# Altium project diplomka_hiearchical.PrjPcb (part 2 of 4)

## Sheet TPs.SchDoc
size A4; DocumentNumber: 2; SheetNumber: 4; SheetTotal: 5
Used 40 times, as channels U_ALL_channels/8pins1/dTP, U_ALL_channels/8pins1/dTP, U_ALL_channels/8pins1/dTP, U_ALL_channels/8pins1/dTP, U_ALL_channels/8pins2/dTP, U_ALL_channels/8pins2/dTP, U_ALL_channels/8pins2/dTP, U_ALL_channels/8pins2/dTP, U_ALL_channels/8pins3/dTP, U_ALL_channels/8pins3/dTP, U_ALL_channels/8pins3/dTP, U_ALL_channels/8pins3/dTP, U_ALL_channels/8pins4/dTP, U_ALL_channels/8pins4/dTP, U_ALL_channels/8pins4/dTP, U_ALL_channels/8pins4/dTP, U_ALL_channels/8pins5/dTP, U_ALL_channels/8pins5/dTP, U_ALL_channels/8pins5/dTP, U_ALL_channels/8pins5/dTP, U_ALL_channels/8pins6/dTP, U_ALL_channels/8pins6/dTP, U_ALL_channels/8pins6/dTP, U_ALL_channels/8pins6/dTP, U_ALL_channels/8pins7/dTP, U_ALL_channels/8pins7/dTP, U_ALL_channels/8pins7/dTP, U_ALL_channels/8pins7/dTP, U_ALL_channels/8pins8/dTP, U_ALL_channels/8pins8/dTP, U_ALL_channels/8pins8/dTP, U_ALL_channels/8pins8/dTP, U_ALL_channels/8pins9/dTP, U_ALL_channels/8pins9/dTP, U_ALL_channels/8pins9/dTP, U_ALL_channels/8pins9/dTP, U_ALL_channels/8pins10/dTP, U_ALL_channels/8pins10/dTP, U_ALL_channels/8pins10/dTP, U_ALL_channels/8pins10/dTP. Parts and nets are listed once, with the designators drawn on the sheet.
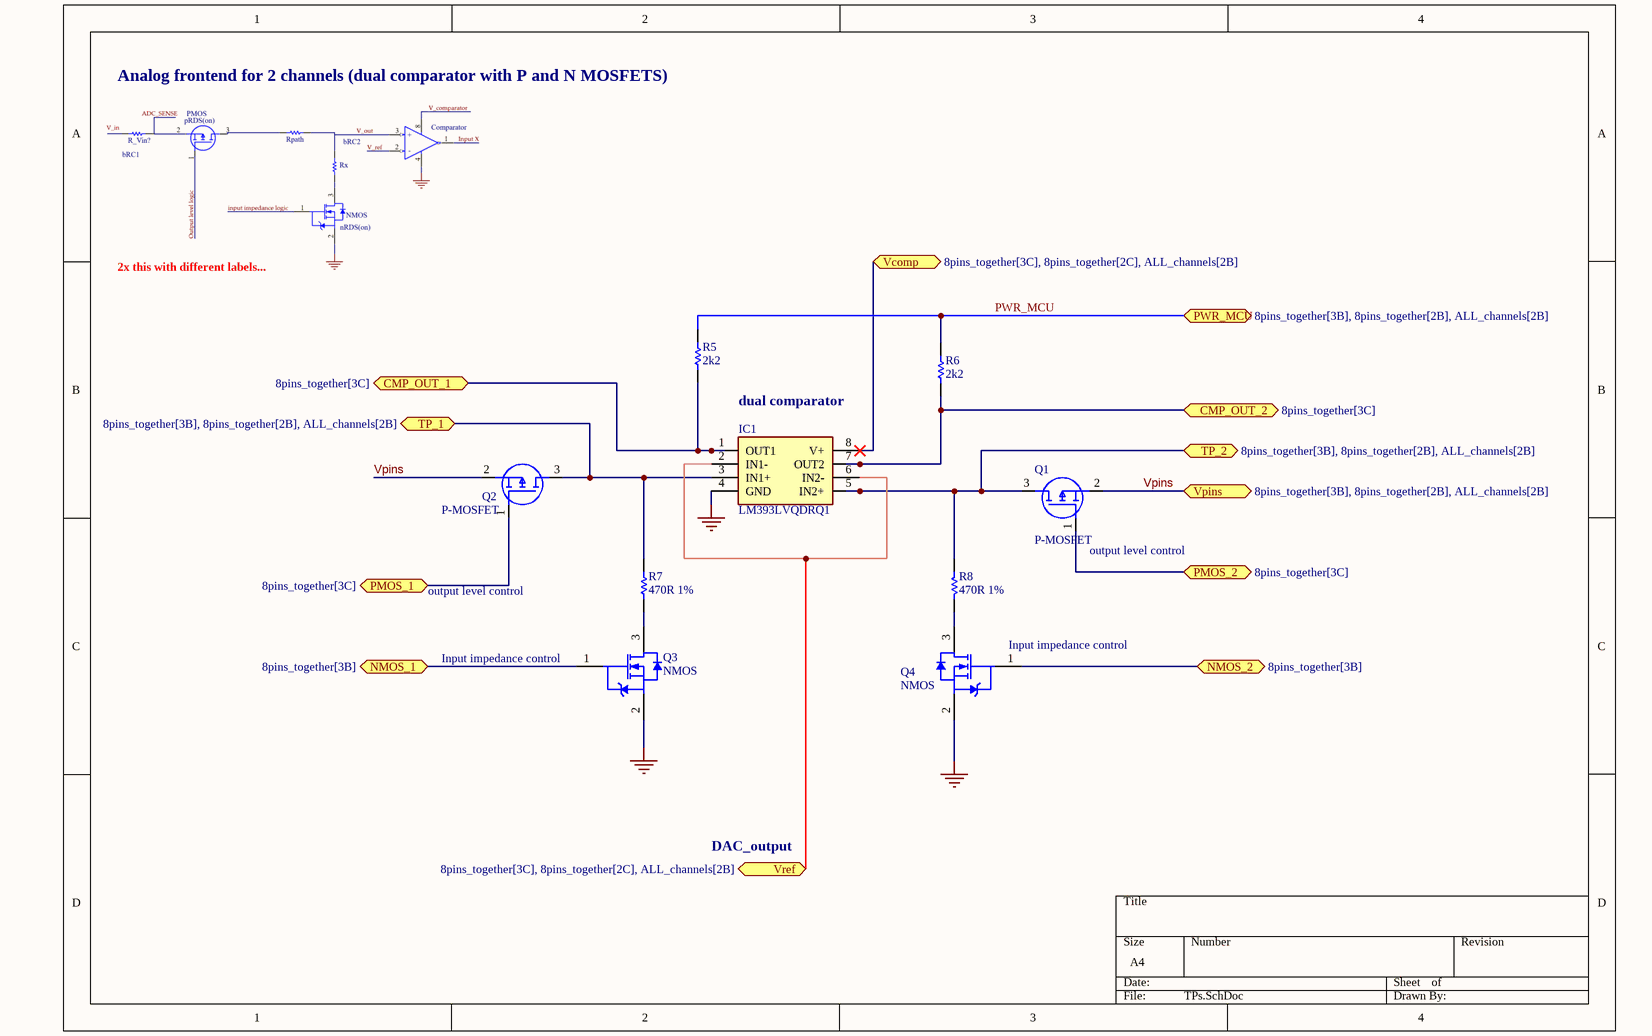
[diagram p3: TPs.SchDoc]

### Parts
IC1  LM393LVQDRQ1  [SOIC127P600X175-8N]
Q1  P-MOSFET  [SOTFL95P240X88-3N]
Q2  P-MOSFET  [SOTFL95P240X88-3N]
Q3  NMOS  [SOT95P240X110-3N]
Q4  NMOS  [SOT95P240X110-3N]
R5  2k2  [RESC1005X40X25NL05T05]
R6  2k2  [RESC1005X40X25NL05T05]
R7  470R 1%  [RESC1005X40X25NL05T05]
R8  470R 1%  [RESC1005X40X25NL05T05]

### Ports
CMP_OUT_1 (bidir, see 8pins_together[3C]), CMP_OUT_2 (bidir, see 8pins_together[3C]), NMOS_1 (bidir, see 8pins_together[3B]), NMOS_2 (bidir, see 8pins_together[3B]), PMOS_1 (bidir, see 8pins_together[3C]), PMOS_2 (bidir, see 8pins_together[3C]), PWR_MCU (bidir, see 8pins_together[3B], 8pins_together[2B], ALL_channels[2B]), TP_1 (bidir, see 8pins_together[3B], 8pins_together[2B], ALL_channels[2B]), TP_2 (bidir, see 8pins_together[3B], 8pins_together[2B], ALL_channels[2B]), Vcomp (bidir, see 8pins_together[3C], 8pins_together[2C], ALL_channels[2B]), Vpins (bidir, see 8pins_together[3B], 8pins_together[2B], ALL_channels[2B]), Vref (bidir, see 8pins_together[3C], 8pins_together[2C], ALL_channels[2B])

### Nets
GND: IC1.4(GND) Q3.2(S) Q4.2(S)
CMP_OUT_1: IC1.1(OUT1) R5.2 ; port CMP_OUT_1
CMP_OUT_2: IC1.7(OUT2) R6.2 ; port CMP_OUT_2
NMOS_1: Q3.1(G) ; port NMOS_1
NMOS_2: Q4.1(G) ; port NMOS_2
PMOS_1: Q2.1(G) ; port PMOS_1
PMOS_2: Q1.1(G) ; port PMOS_2
PWR_MCU: R5.1 R6.1 ; port PWR_MCU
TP_1: IC1.3(IN1+) Q2.3(D) R7.1 ; port TP_1
TP_2: IC1.5(IN2+) Q1.3(D) R8.1 ; port TP_2
Vcomp: IC1.8(V+) ; port Vcomp
Vpins: Q1.2(S) Q2.2(S) ; port Vpins
Vref: IC1.2(IN1-) IC1.6(IN2-) ; port Vref
NetQ3_3: Q3.3(D) R7.2
NetQ4_3: Q4.3(D) R8.2

### Channels
U_ALL_channels/8pins1/dTP: designators IC1=U_ALL_channels_8pins1_dTP_IC1#1 Q1=U_ALL_channels_8pins1_dTP_Q1#1 Q2=U_ALL_channels_8pins1_dTP_Q2#1 Q3=U_ALL_channels_8pins1_dTP_Q3#1 Q4=U_ALL_channels_8pins1_dTP_Q4#1 R5=U_ALL_channels_8pins1_dTP_R5#1 R6=U_ALL_channels_8pins1_dTP_R6#1 R7=U_ALL_channels_8pins1_dTP_R7#1 R8=U_ALL_channels_8pins1_dTP_R8#1; ports CMP_OUT_1=Net8pins1_U3_2 CMP_OUT_2=Net8pins1_U3_4 NMOS_1=Net8pins1_U2_6 NMOS_2=Net8pins1_U2_7 PMOS_1=Net8pins1_U4_6 PMOS_2=Net8pins1_U4_7 PWR_MCU=PWR_MCU TP_1=TP_7 TP_2=TP_8 Vcomp=Vcomp Vpins=Vpins Vref=Vref
U_ALL_channels/8pins1/dTP: designators IC1=U_ALL_channels_8pins1_dTP_IC1#2 Q1=U_ALL_channels_8pins1_dTP_Q1#2 Q2=U_ALL_channels_8pins1_dTP_Q2#2 Q3=U_ALL_channels_8pins1_dTP_Q3#2 Q4=U_ALL_channels_8pins1_dTP_Q4#2 R5=U_ALL_channels_8pins1_dTP_R5#2 R6=U_ALL_channels_8pins1_dTP_R6#2 R7=U_ALL_channels_8pins1_dTP_R7#2 R8=U_ALL_channels_8pins1_dTP_R8#2; ports CMP_OUT_1=Net8pins1_U3_1 CMP_OUT_2=Net8pins1_U3_5 NMOS_1=Net8pins1_U2_4 NMOS_2=Net8pins1_U2_5 PMOS_1=Net8pins1_U4_4 PMOS_2=Net8pins1_U4_5 PWR_MCU=PWR_MCU TP_1=TP_5 TP_2=TP_6 Vcomp=Vcomp Vpins=Vpins Vref=Vref
U_ALL_channels/8pins1/dTP: designators IC1=U_ALL_channels_8pins1_dTP_IC1#3 Q1=U_ALL_channels_8pins1_dTP_Q1#3 Q2=U_ALL_channels_8pins1_dTP_Q2#3 Q3=U_ALL_channels_8pins1_dTP_Q3#3 Q4=U_ALL_channels_8pins1_dTP_Q4#3 R5=U_ALL_channels_8pins1_dTP_R5#3 R6=U_ALL_channels_8pins1_dTP_R6#3 R7=U_ALL_channels_8pins1_dTP_R7#3 R8=U_ALL_channels_8pins1_dTP_R8#3; ports CMP_OUT_1=Net8pins1_U3_15 CMP_OUT_2=Net8pins1_U3_12 NMOS_1=Net8pins1_U2_2 NMOS_2=Net8pins1_U2_3 PMOS_1=Net8pins1_U4_2 PMOS_2=Net8pins1_U4_3 PWR_MCU=PWR_MCU TP_1=TP_3 TP_2=TP_4 Vcomp=Vcomp Vpins=Vpins Vref=Vref
U_ALL_channels/8pins1/dTP: designators IC1=U_ALL_channels_8pins1_dTP_IC1#4 Q1=U_ALL_channels_8pins1_dTP_Q1#4 Q2=U_ALL_channels_8pins1_dTP_Q2#4 Q3=U_ALL_channels_8pins1_dTP_Q3#4 Q4=U_ALL_channels_8pins1_dTP_Q4#4 R5=U_ALL_channels_8pins1_dTP_R5#4 R6=U_ALL_channels_8pins1_dTP_R6#4 R7=U_ALL_channels_8pins1_dTP_R7#4 R8=U_ALL_channels_8pins1_dTP_R8#4; ports CMP_OUT_1=Net8pins1_U3_13 CMP_OUT_2=Net8pins1_U3_14 NMOS_1=Net8pins1_U2_15 NMOS_2=Net8pins1_U2_1 PMOS_1=Net8pins1_U4_15 PMOS_2=Net8pins1_U4_1 PWR_MCU=PWR_MCU TP_1=TP_1 TP_2=TP_2 Vcomp=Vcomp Vpins=Vpins Vref=Vref
U_ALL_channels/8pins2/dTP: designators IC1=U_ALL_channels_8pins2_dTP_IC1#1 Q1=U_ALL_channels_8pins2_dTP_Q1#1 Q2=U_ALL_channels_8pins2_dTP_Q2#1 Q3=U_ALL_channels_8pins2_dTP_Q3#1 Q4=U_ALL_channels_8pins2_dTP_Q4#1 R5=U_ALL_channels_8pins2_dTP_R5#1 R6=U_ALL_channels_8pins2_dTP_R6#1 R7=U_ALL_channels_8pins2_dTP_R7#1 R8=U_ALL_channels_8pins2_dTP_R8#1; ports CMP_OUT_1=Net8pins2_U3_2 CMP_OUT_2=Net8pins2_U3_4 NMOS_1=Net8pins2_U2_6 NMOS_2=Net8pins2_U2_7 PMOS_1=Net8pins2_U4_6 PMOS_2=Net8pins2_U4_7 PWR_MCU=PWR_MCU TP_1=TP_15 TP_2=TP_16 Vcomp=Vcomp Vpins=Vpins Vref=Vref
U_ALL_channels/8pins2/dTP: designators IC1=U_ALL_channels_8pins2_dTP_IC1#2 Q1=U_ALL_channels_8pins2_dTP_Q1#2 Q2=U_ALL_channels_8pins2_dTP_Q2#2 Q3=U_ALL_channels_8pins2_dTP_Q3#2 Q4=U_ALL_channels_8pins2_dTP_Q4#2 R5=U_ALL_channels_8pins2_dTP_R5#2 R6=U_ALL_channels_8pins2_dTP_R6#2 R7=U_ALL_channels_8pins2_dTP_R7#2 R8=U_ALL_channels_8pins2_dTP_R8#2; ports CMP_OUT_1=Net8pins2_U3_1 CMP_OUT_2=Net8pins2_U3_5 NMOS_1=Net8pins2_U2_4 NMOS_2=Net8pins2_U2_5 PMOS_1=Net8pins2_U4_4 PMOS_2=Net8pins2_U4_5 PWR_MCU=PWR_MCU TP_1=TP_13 TP_2=TP_14 Vcomp=Vcomp Vpins=Vpins Vref=Vref
U_ALL_channels/8pins2/dTP: designators IC1=U_ALL_channels_8pins2_dTP_IC1#3 Q1=U_ALL_channels_8pins2_dTP_Q1#3 Q2=U_ALL_channels_8pins2_dTP_Q2#3 Q3=U_ALL_channels_8pins2_dTP_Q3#3 Q4=U_ALL_channels_8pins2_dTP_Q4#3 R5=U_ALL_channels_8pins2_dTP_R5#3 R6=U_ALL_channels_8pins2_dTP_R6#3 R7=U_ALL_channels_8pins2_dTP_R7#3 R8=U_ALL_channels_8pins2_dTP_R8#3; ports CMP_OUT_1=Net8pins2_U3_15 CMP_OUT_2=Net8pins2_U3_12 NMOS_1=Net8pins2_U2_2 NMOS_2=Net8pins2_U2_3 PMOS_1=Net8pins2_U4_2 PMOS_2=Net8pins2_U4_3 PWR_MCU=PWR_MCU TP_1=TP_11 TP_2=TP_12 Vcomp=Vcomp Vpins=Vpins Vref=Vref
U_ALL_channels/8pins2/dTP: designators IC1=U_ALL_channels_8pins2_dTP_IC1#4 Q1=U_ALL_channels_8pins2_dTP_Q1#4 Q2=U_ALL_channels_8pins2_dTP_Q2#4 Q3=U_ALL_channels_8pins2_dTP_Q3#4 Q4=U_ALL_channels_8pins2_dTP_Q4#4 R5=U_ALL_channels_8pins2_dTP_R5#4 R6=U_ALL_channels_8pins2_dTP_R6#4 R7=U_ALL_channels_8pins2_dTP_R7#4 R8=U_ALL_channels_8pins2_dTP_R8#4; ports CMP_OUT_1=Net8pins2_U3_13 CMP_OUT_2=Net8pins2_U3_14 NMOS_1=Net8pins2_U2_15 NMOS_2=Net8pins2_U2_1 PMOS_1=Net8pins2_U4_15 PMOS_2=Net8pins2_U4_1 PWR_MCU=PWR_MCU TP_1=TP_9 TP_2=TP_10 Vcomp=Vcomp Vpins=Vpins Vref=Vref
U_ALL_channels/8pins3/dTP: designators IC1=U_ALL_channels_8pins3_dTP_IC1#1 Q1=U_ALL_channels_8pins3_dTP_Q1#1 Q2=U_ALL_channels_8pins3_dTP_Q2#1 Q3=U_ALL_channels_8pins3_dTP_Q3#1 Q4=U_ALL_channels_8pins3_dTP_Q4#1 R5=U_ALL_channels_8pins3_dTP_R5#1 R6=U_ALL_channels_8pins3_dTP_R6#1 R7=U_ALL_channels_8pins3_dTP_R7#1 R8=U_ALL_channels_8pins3_dTP_R8#1; ports CMP_OUT_1=Net8pins3_U3_2 CMP_OUT_2=Net8pins3_U3_4 NMOS_1=Net8pins3_U2_6 NMOS_2=Net8pins3_U2_7 PMOS_1=Net8pins3_U4_6 PMOS_2=Net8pins3_U4_7 PWR_MCU=PWR_MCU TP_1=TP_23 TP_2=TP_24 Vcomp=Vcomp Vpins=Vpins Vref=Vref
U_ALL_channels/8pins3/dTP: designators IC1=U_ALL_channels_8pins3_dTP_IC1#2 Q1=U_ALL_channels_8pins3_dTP_Q1#2 Q2=U_ALL_channels_8pins3_dTP_Q2#2 Q3=U_ALL_channels_8pins3_dTP_Q3#2 Q4=U_ALL_channels_8pins3_dTP_Q4#2 R5=U_ALL_channels_8pins3_dTP_R5#2 R6=U_ALL_channels_8pins3_dTP_R6#2 R7=U_ALL_channels_8pins3_dTP_R7#2 R8=U_ALL_channels_8pins3_dTP_R8#2; ports CMP_OUT_1=Net8pins3_U3_1 CMP_OUT_2=Net8pins3_U3_5 NMOS_1=Net8pins3_U2_4 NMOS_2=Net8pins3_U2_5 PMOS_1=Net8pins3_U4_4 PMOS_2=Net8pins3_U4_5 PWR_MCU=PWR_MCU TP_1=TP_21 TP_2=TP_22 Vcomp=Vcomp Vpins=Vpins Vref=Vref
U_ALL_channels/8pins3/dTP: designators IC1=U_ALL_channels_8pins3_dTP_IC1#3 Q1=U_ALL_channels_8pins3_dTP_Q1#3 Q2=U_ALL_channels_8pins3_dTP_Q2#3 Q3=U_ALL_channels_8pins3_dTP_Q3#3 Q4=U_ALL_channels_8pins3_dTP_Q4#3 R5=U_ALL_channels_8pins3_dTP_R5#3 R6=U_ALL_channels_8pins3_dTP_R6#3 R7=U_ALL_channels_8pins3_dTP_R7#3 R8=U_ALL_channels_8pins3_dTP_R8#3; ports CMP_OUT_1=Net8pins3_U3_15 CMP_OUT_2=Net8pins3_U3_12 NMOS_1=Net8pins3_U2_2 NMOS_2=Net8pins3_U2_3 PMOS_1=Net8pins3_U4_2 PMOS_2=Net8pins3_U4_3 PWR_MCU=PWR_MCU TP_1=TP_19 TP_2=TP_20 Vcomp=Vcomp Vpins=Vpins Vref=Vref
U_ALL_channels/8pins3/dTP: designators IC1=U_ALL_channels_8pins3_dTP_IC1#4 Q1=U_ALL_channels_8pins3_dTP_Q1#4 Q2=U_ALL_channels_8pins3_dTP_Q2#4 Q3=U_ALL_channels_8pins3_dTP_Q3#4 Q4=U_ALL_channels_8pins3_dTP_Q4#4 R5=U_ALL_channels_8pins3_dTP_R5#4 R6=U_ALL_channels_8pins3_dTP_R6#4 R7=U_ALL_channels_8pins3_dTP_R7#4 R8=U_ALL_channels_8pins3_dTP_R8#4; ports CMP_OUT_1=Net8pins3_U3_13 CMP_OUT_2=Net8pins3_U3_14 NMOS_1=Net8pins3_U2_15 NMOS_2=Net8pins3_U2_1 PMOS_1=Net8pins3_U4_15 PMOS_2=Net8pins3_U4_1 PWR_MCU=PWR_MCU TP_1=TP_17 TP_2=TP_18 Vcomp=Vcomp Vpins=Vpins Vref=Vref
U_ALL_channels/8pins4/dTP: designators IC1=U_ALL_channels_8pins4_dTP_IC1#1 Q1=U_ALL_channels_8pins4_dTP_Q1#1 Q2=U_ALL_channels_8pins4_dTP_Q2#1 Q3=U_ALL_channels_8pins4_dTP_Q3#1 Q4=U_ALL_channels_8pins4_dTP_Q4#1 R5=U_ALL_channels_8pins4_dTP_R5#1 R6=U_ALL_channels_8pins4_dTP_R6#1 R7=U_ALL_channels_8pins4_dTP_R7#1 R8=U_ALL_channels_8pins4_dTP_R8#1; ports CMP_OUT_1=Net8pins4_U3_2 CMP_OUT_2=Net8pins4_U3_4 NMOS_1=Net8pins4_U2_6 NMOS_2=Net8pins4_U2_7 PMOS_1=Net8pins4_U4_6 PMOS_2=Net8pins4_U4_7 PWR_MCU=PWR_MCU TP_1=TP_31 TP_2=TP_32 Vcomp=Vcomp Vpins=Vpins Vref=Vref
U_ALL_channels/8pins4/dTP: designators IC1=U_ALL_channels_8pins4_dTP_IC1#2 Q1=U_ALL_channels_8pins4_dTP_Q1#2 Q2=U_ALL_channels_8pins4_dTP_Q2#2 Q3=U_ALL_channels_8pins4_dTP_Q3#2 Q4=U_ALL_channels_8pins4_dTP_Q4#2 R5=U_ALL_channels_8pins4_dTP_R5#2 R6=U_ALL_channels_8pins4_dTP_R6#2 R7=U_ALL_channels_8pins4_dTP_R7#2 R8=U_ALL_channels_8pins4_dTP_R8#2; ports CMP_OUT_1=Net8pins4_U3_1 CMP_OUT_2=Net8pins4_U3_5 NMOS_1=Net8pins4_U2_4 NMOS_2=Net8pins4_U2_5 PMOS_1=Net8pins4_U4_4 PMOS_2=Net8pins4_U4_5 PWR_MCU=PWR_MCU TP_1=TP_29 TP_2=TP_30 Vcomp=Vcomp Vpins=Vpins Vref=Vref
U_ALL_channels/8pins4/dTP: designators IC1=U_ALL_channels_8pins4_dTP_IC1#3 Q1=U_ALL_channels_8pins4_dTP_Q1#3 Q2=U_ALL_channels_8pins4_dTP_Q2#3 Q3=U_ALL_channels_8pins4_dTP_Q3#3 Q4=U_ALL_channels_8pins4_dTP_Q4#3 R5=U_ALL_channels_8pins4_dTP_R5#3 R6=U_ALL_channels_8pins4_dTP_R6#3 R7=U_ALL_channels_8pins4_dTP_R7#3 R8=U_ALL_channels_8pins4_dTP_R8#3; ports CMP_OUT_1=Net8pins4_U3_15 CMP_OUT_2=Net8pins4_U3_12 NMOS_1=Net8pins4_U2_2 NMOS_2=Net8pins4_U2_3 PMOS_1=Net8pins4_U4_2 PMOS_2=Net8pins4_U4_3 PWR_MCU=PWR_MCU TP_1=TP_27 TP_2=TP_28 Vcomp=Vcomp Vpins=Vpins Vref=Vref
U_ALL_channels/8pins4/dTP: designators IC1=U_ALL_channels_8pins4_dTP_IC1#4 Q1=U_ALL_channels_8pins4_dTP_Q1#4 Q2=U_ALL_channels_8pins4_dTP_Q2#4 Q3=U_ALL_channels_8pins4_dTP_Q3#4 Q4=U_ALL_channels_8pins4_dTP_Q4#4 R5=U_ALL_channels_8pins4_dTP_R5#4 R6=U_ALL_channels_8pins4_dTP_R6#4 R7=U_ALL_channels_8pins4_dTP_R7#4 R8=U_ALL_channels_8pins4_dTP_R8#4; ports CMP_OUT_1=Net8pins4_U3_13 CMP_OUT_2=Net8pins4_U3_14 NMOS_1=Net8pins4_U2_15 NMOS_2=Net8pins4_U2_1 PMOS_1=Net8pins4_U4_15 PMOS_2=Net8pins4_U4_1 PWR_MCU=PWR_MCU TP_1=TP_25 TP_2=TP_26 Vcomp=Vcomp Vpins=Vpins Vref=Vref
U_ALL_channels/8pins5/dTP: designators IC1=U_ALL_channels_8pins5_dTP_IC1#1 Q1=U_ALL_channels_8pins5_dTP_Q1#1 Q2=U_ALL_channels_8pins5_dTP_Q2#1 Q3=U_ALL_channels_8pins5_dTP_Q3#1 Q4=U_ALL_channels_8pins5_dTP_Q4#1 R5=U_ALL_channels_8pins5_dTP_R5#1 R6=U_ALL_channels_8pins5_dTP_R6#1 R7=U_ALL_channels_8pins5_dTP_R7#1 R8=U_ALL_channels_8pins5_dTP_R8#1; ports CMP_OUT_1=Net8pins5_U3_2 CMP_OUT_2=Net8pins5_U3_4 NMOS_1=Net8pins5_U2_6 NMOS_2=Net8pins5_U2_7 PMOS_1=Net8pins5_U4_6 PMOS_2=Net8pins5_U4_7 PWR_MCU=PWR_MCU TP_1=TP_39 TP_2=TP_40 Vcomp=Vcomp Vpins=Vpins Vref=Vref
U_ALL_channels/8pins5/dTP: designators IC1=U_ALL_channels_8pins5_dTP_IC1#2 Q1=U_ALL_channels_8pins5_dTP_Q1#2 Q2=U_ALL_channels_8pins5_dTP_Q2#2 Q3=U_ALL_channels_8pins5_dTP_Q3#2 Q4=U_ALL_channels_8pins5_dTP_Q4#2 R5=U_ALL_channels_8pins5_dTP_R5#2 R6=U_ALL_channels_8pins5_dTP_R6#2 R7=U_ALL_channels_8pins5_dTP_R7#2 R8=U_ALL_channels_8pins5_dTP_R8#2; ports CMP_OUT_1=Net8pins5_U3_1 CMP_OUT_2=Net8pins5_U3_5 NMOS_1=Net8pins5_U2_4 NMOS_2=Net8pins5_U2_5 PMOS_1=Net8pins5_U4_4 PMOS_2=Net8pins5_U4_5 PWR_MCU=PWR_MCU TP_1=TP_37 TP_2=TP_38 Vcomp=Vcomp Vpins=Vpins Vref=Vref
U_ALL_channels/8pins5/dTP: designators IC1=U_ALL_channels_8pins5_dTP_IC1#3 Q1=U_ALL_channels_8pins5_dTP_Q1#3 Q2=U_ALL_channels_8pins5_dTP_Q2#3 Q3=U_ALL_channels_8pins5_dTP_Q3#3 Q4=U_ALL_channels_8pins5_dTP_Q4#3 R5=U_ALL_channels_8pins5_dTP_R5#3 R6=U_ALL_channels_8pins5_dTP_R6#3 R7=U_ALL_channels_8pins5_dTP_R7#3 R8=U_ALL_channels_8pins5_dTP_R8#3; ports CMP_OUT_1=Net8pins5_U3_15 CMP_OUT_2=Net8pins5_U3_12 NMOS_1=Net8pins5_U2_2 NMOS_2=Net8pins5_U2_3 PMOS_1=Net8pins5_U4_2 PMOS_2=Net8pins5_U4_3 PWR_MCU=PWR_MCU TP_1=TP_35 TP_2=TP_36 Vcomp=Vcomp Vpins=Vpins Vref=Vref
U_ALL_channels/8pins5/dTP: designators IC1=U_ALL_channels_8pins5_dTP_IC1#4 Q1=U_ALL_channels_8pins5_dTP_Q1#4 Q2=U_ALL_channels_8pins5_dTP_Q2#4 Q3=U_ALL_channels_8pins5_dTP_Q3#4 Q4=U_ALL_channels_8pins5_dTP_Q4#4 R5=U_ALL_channels_8pins5_dTP_R5#4 R6=U_ALL_channels_8pins5_dTP_R6#4 R7=U_ALL_channels_8pins5_dTP_R7#4 R8=U_ALL_channels_8pins5_dTP_R8#4; ports CMP_OUT_1=Net8pins5_U3_13 CMP_OUT_2=Net8pins5_U3_14 NMOS_1=Net8pins5_U2_15 NMOS_2=Net8pins5_U2_1 PMOS_1=Net8pins5_U4_15 PMOS_2=Net8pins5_U4_1 PWR_MCU=PWR_MCU TP_1=TP_33 TP_2=TP_34 Vcomp=Vcomp Vpins=Vpins Vref=Vref
U_ALL_channels/8pins6/dTP: designators IC1=U_ALL_channels_8pins6_dTP_IC1#1 Q1=U_ALL_channels_8pins6_dTP_Q1#1 Q2=U_ALL_channels_8pins6_dTP_Q2#1 Q3=U_ALL_channels_8pins6_dTP_Q3#1 Q4=U_ALL_channels_8pins6_dTP_Q4#1 R5=U_ALL_channels_8pins6_dTP_R5#1 R6=U_ALL_channels_8pins6_dTP_R6#1 R7=U_ALL_channels_8pins6_dTP_R7#1 R8=U_ALL_channels_8pins6_dTP_R8#1; ports CMP_OUT_1=Net8pins6_U3_2 CMP_OUT_2=Net8pins6_U3_4 NMOS_1=Net8pins6_U2_6 NMOS_2=Net8pins6_U2_7 PMOS_1=Net8pins6_U4_6 PMOS_2=Net8pins6_U4_7 PWR_MCU=PWR_MCU TP_1=TP_47 TP_2=TP_48 Vcomp=Vcomp Vpins=Vpins Vref=Vref
U_ALL_channels/8pins6/dTP: designators IC1=U_ALL_channels_8pins6_dTP_IC1#2 Q1=U_ALL_channels_8pins6_dTP_Q1#2 Q2=U_ALL_channels_8pins6_dTP_Q2#2 Q3=U_ALL_channels_8pins6_dTP_Q3#2 Q4=U_ALL_channels_8pins6_dTP_Q4#2 R5=U_ALL_channels_8pins6_dTP_R5#2 R6=U_ALL_channels_8pins6_dTP_R6#2 R7=U_ALL_channels_8pins6_dTP_R7#2 R8=U_ALL_channels_8pins6_dTP_R8#2; ports CMP_OUT_1=Net8pins6_U3_1 CMP_OUT_2=Net8pins6_U3_5 NMOS_1=Net8pins6_U2_4 NMOS_2=Net8pins6_U2_5 PMOS_1=Net8pins6_U4_4 PMOS_2=Net8pins6_U4_5 PWR_MCU=PWR_MCU TP_1=TP_45 TP_2=TP_46 Vcomp=Vcomp Vpins=Vpins Vref=Vref
U_ALL_channels/8pins6/dTP: designators IC1=U_ALL_channels_8pins6_dTP_IC1#3 Q1=U_ALL_channels_8pins6_dTP_Q1#3 Q2=U_ALL_channels_8pins6_dTP_Q2#3 Q3=U_ALL_channels_8pins6_dTP_Q3#3 Q4=U_ALL_channels_8pins6_dTP_Q4#3 R5=U_ALL_channels_8pins6_dTP_R5#3 R6=U_ALL_channels_8pins6_dTP_R6#3 R7=U_ALL_channels_8pins6_dTP_R7#3 R8=U_ALL_channels_8pins6_dTP_R8#3; ports CMP_OUT_1=Net8pins6_U3_15 CMP_OUT_2=Net8pins6_U3_12 NMOS_1=Net8pins6_U2_2 NMOS_2=Net8pins6_U2_3 PMOS_1=Net8pins6_U4_2 PMOS_2=Net8pins6_U4_3 PWR_MCU=PWR_MCU TP_1=TP_43 TP_2=TP_44 Vcomp=Vcomp Vpins=Vpins Vref=Vref
U_ALL_channels/8pins6/dTP: designators IC1=U_ALL_channels_8pins6_dTP_IC1#4 Q1=U_ALL_channels_8pins6_dTP_Q1#4 Q2=U_ALL_channels_8pins6_dTP_Q2#4 Q3=U_ALL_channels_8pins6_dTP_Q3#4 Q4=U_ALL_channels_8pins6_dTP_Q4#4 R5=U_ALL_channels_8pins6_dTP_R5#4 R6=U_ALL_channels_8pins6_dTP_R6#4 R7=U_ALL_channels_8pins6_dTP_R7#4 R8=U_ALL_channels_8pins6_dTP_R8#4; ports CMP_OUT_1=Net8pins6_U3_13 CMP_OUT_2=Net8pins6_U3_14 NMOS_1=Net8pins6_U2_15 NMOS_2=Net8pins6_U2_1 PMOS_1=Net8pins6_U4_15 PMOS_2=Net8pins6_U4_1 PWR_MCU=PWR_MCU TP_1=TP_41 TP_2=TP_42 Vcomp=Vcomp Vpins=Vpins Vref=Vref
U_ALL_channels/8pins7/dTP: designators IC1=U_ALL_channels_8pins7_dTP_IC1#1 Q1=U_ALL_channels_8pins7_dTP_Q1#1 Q2=U_ALL_channels_8pins7_dTP_Q2#1 Q3=U_ALL_channels_8pins7_dTP_Q3#1 Q4=U_ALL_channels_8pins7_dTP_Q4#1 R5=U_ALL_channels_8pins7_dTP_R5#1 R6=U_ALL_channels_8pins7_dTP_R6#1 R7=U_ALL_channels_8pins7_dTP_R7#1 R8=U_ALL_channels_8pins7_dTP_R8#1; ports CMP_OUT_1=Net8pins7_U3_2 CMP_OUT_2=Net8pins7_U3_4 NMOS_1=Net8pins7_U2_6 NMOS_2=Net8pins7_U2_7 PMOS_1=Net8pins7_U4_6 PMOS_2=Net8pins7_U4_7 PWR_MCU=PWR_MCU TP_1=TP_55 TP_2=TP_56 Vcomp=Vcomp Vpins=Vpins Vref=Vref
U_ALL_channels/8pins7/dTP: designators IC1=U_ALL_channels_8pins7_dTP_IC1#2 Q1=U_ALL_channels_8pins7_dTP_Q1#2 Q2=U_ALL_channels_8pins7_dTP_Q2#2 Q3=U_ALL_channels_8pins7_dTP_Q3#2 Q4=U_ALL_channels_8pins7_dTP_Q4#2 R5=U_ALL_channels_8pins7_dTP_R5#2 R6=U_ALL_channels_8pins7_dTP_R6#2 R7=U_ALL_channels_8pins7_dTP_R7#2 R8=U_ALL_channels_8pins7_dTP_R8#2; ports CMP_OUT_1=Net8pins7_U3_1 CMP_OUT_2=Net8pins7_U3_5 NMOS_1=Net8pins7_U2_4 NMOS_2=Net8pins7_U2_5 PMOS_1=Net8pins7_U4_4 PMOS_2=Net8pins7_U4_5 PWR_MCU=PWR_MCU TP_1=TP_53 TP_2=TP_54 Vcomp=Vcomp Vpins=Vpins Vref=Vref
U_ALL_channels/8pins7/dTP: designators IC1=U_ALL_channels_8pins7_dTP_IC1#3 Q1=U_ALL_channels_8pins7_dTP_Q1#3 Q2=U_ALL_channels_8pins7_dTP_Q2#3 Q3=U_ALL_channels_8pins7_dTP_Q3#3 Q4=U_ALL_channels_8pins7_dTP_Q4#3 R5=U_ALL_channels_8pins7_dTP_R5#3 R6=U_ALL_channels_8pins7_dTP_R6#3 R7=U_ALL_channels_8pins7_dTP_R7#3 R8=U_ALL_channels_8pins7_dTP_R8#3; ports CMP_OUT_1=Net8pins7_U3_15 CMP_OUT_2=Net8pins7_U3_12 NMOS_1=Net8pins7_U2_2 NMOS_2=Net8pins7_U2_3 PMOS_1=Net8pins7_U4_2 PMOS_2=Net8pins7_U4_3 PWR_MCU=PWR_MCU TP_1=TP_51 TP_2=TP_52 Vcomp=Vcomp Vpins=Vpins Vref=Vref
U_ALL_channels/8pins7/dTP: designators IC1=U_ALL_channels_8pins7_dTP_IC1#4 Q1=U_ALL_channels_8pins7_dTP_Q1#4 Q2=U_ALL_channels_8pins7_dTP_Q2#4 Q3=U_ALL_channels_8pins7_dTP_Q3#4 Q4=U_ALL_channels_8pins7_dTP_Q4#4 R5=U_ALL_channels_8pins7_dTP_R5#4 R6=U_ALL_channels_8pins7_dTP_R6#4 R7=U_ALL_channels_8pins7_dTP_R7#4 R8=U_ALL_channels_8pins7_dTP_R8#4; ports CMP_OUT_1=Net8pins7_U3_13 CMP_OUT_2=Net8pins7_U3_14 NMOS_1=Net8pins7_U2_15 NMOS_2=Net8pins7_U2_1 PMOS_1=Net8pins7_U4_15 PMOS_2=Net8pins7_U4_1 PWR_MCU=PWR_MCU TP_1=TP_49 TP_2=TP_50 Vcomp=Vcomp Vpins=Vpins Vref=Vref
U_ALL_channels/8pins8/dTP: designators IC1=U_ALL_channels_8pins8_dTP_IC1#1 Q1=U_ALL_channels_8pins8_dTP_Q1#1 Q2=U_ALL_channels_8pins8_dTP_Q2#1 Q3=U_ALL_channels_8pins8_dTP_Q3#1 Q4=U_ALL_channels_8pins8_dTP_Q4#1 R5=U_ALL_channels_8pins8_dTP_R5#1 R6=U_ALL_channels_8pins8_dTP_R6#1 R7=U_ALL_channels_8pins8_dTP_R7#1 R8=U_ALL_channels_8pins8_dTP_R8#1; ports CMP_OUT_1=Net8pins8_U3_2 CMP_OUT_2=Net8pins8_U3_4 NMOS_1=Net8pins8_U2_6 NMOS_2=Net8pins8_U2_7 PMOS_1=Net8pins8_U4_6 PMOS_2=Net8pins8_U4_7 PWR_MCU=PWR_MCU TP_1=TP_63 TP_2=TP_64 Vcomp=Vcomp Vpins=Vpins Vref=Vref
U_ALL_channels/8pins8/dTP: designators IC1=U_ALL_channels_8pins8_dTP_IC1#2 Q1=U_ALL_channels_8pins8_dTP_Q1#2 Q2=U_ALL_channels_8pins8_dTP_Q2#2 Q3=U_ALL_channels_8pins8_dTP_Q3#2 Q4=U_ALL_channels_8pins8_dTP_Q4#2 R5=U_ALL_channels_8pins8_dTP_R5#2 R6=U_ALL_channels_8pins8_dTP_R6#2 R7=U_ALL_channels_8pins8_dTP_R7#2 R8=U_ALL_channels_8pins8_dTP_R8#2; ports CMP_OUT_1=Net8pins8_U3_1 CMP_OUT_2=Net8pins8_U3_5 NMOS_1=Net8pins8_U2_4 NMOS_2=Net8pins8_U2_5 PMOS_1=Net8pins8_U4_4 PMOS_2=Net8pins8_U4_5 PWR_MCU=PWR_MCU TP_1=TP_61 TP_2=TP_62 Vcomp=Vcomp Vpins=Vpins Vref=Vref
U_ALL_channels/8pins8/dTP: designators IC1=U_ALL_channels_8pins8_dTP_IC1#3 Q1=U_ALL_channels_8pins8_dTP_Q1#3 Q2=U_ALL_channels_8pins8_dTP_Q2#3 Q3=U_ALL_channels_8pins8_dTP_Q3#3 Q4=U_ALL_channels_8pins8_dTP_Q4#3 R5=U_ALL_channels_8pins8_dTP_R5#3 R6=U_ALL_channels_8pins8_dTP_R6#3 R7=U_ALL_channels_8pins8_dTP_R7#3 R8=U_ALL_channels_8pins8_dTP_R8#3; ports CMP_OUT_1=Net8pins8_U3_15 CMP_OUT_2=Net8pins8_U3_12 NMOS_1=Net8pins8_U2_2 NMOS_2=Net8pins8_U2_3 PMOS_1=Net8pins8_U4_2 PMOS_2=Net8pins8_U4_3 PWR_MCU=PWR_MCU TP_1=TP_59 TP_2=TP_60 Vcomp=Vcomp Vpins=Vpins Vref=Vref
U_ALL_channels/8pins8/dTP: designators IC1=U_ALL_channels_8pins8_dTP_IC1#4 Q1=U_ALL_channels_8pins8_dTP_Q1#4 Q2=U_ALL_channels_8pins8_dTP_Q2#4 Q3=U_ALL_channels_8pins8_dTP_Q3#4 Q4=U_ALL_channels_8pins8_dTP_Q4#4 R5=U_ALL_channels_8pins8_dTP_R5#4 R6=U_ALL_channels_8pins8_dTP_R6#4 R7=U_ALL_channels_8pins8_dTP_R7#4 R8=U_ALL_channels_8pins8_dTP_R8#4; ports CMP_OUT_1=Net8pins8_U3_13 CMP_OUT_2=Net8pins8_U3_14 NMOS_1=Net8pins8_U2_15 NMOS_2=Net8pins8_U2_1 PMOS_1=Net8pins8_U4_15 PMOS_2=Net8pins8_U4_1 PWR_MCU=PWR_MCU TP_1=TP_57 TP_2=TP_58 Vcomp=Vcomp Vpins=Vpins Vref=Vref
U_ALL_channels/8pins9/dTP: designators IC1=U_ALL_channels_8pins9_dTP_IC1#1 Q1=U_ALL_channels_8pins9_dTP_Q1#1 Q2=U_ALL_channels_8pins9_dTP_Q2#1 Q3=U_ALL_channels_8pins9_dTP_Q3#1 Q4=U_ALL_channels_8pins9_dTP_Q4#1 R5=U_ALL_channels_8pins9_dTP_R5#1 R6=U_ALL_channels_8pins9_dTP_R6#1 R7=U_ALL_channels_8pins9_dTP_R7#1 R8=U_ALL_channels_8pins9_dTP_R8#1; ports CMP_OUT_1=Net8pins9_U3_2 CMP_OUT_2=Net8pins9_U3_4 NMOS_1=Net8pins9_U2_6 NMOS_2=Net8pins9_U2_7 PMOS_1=Net8pins9_U4_6 PMOS_2=Net8pins9_U4_7 PWR_MCU=PWR_MCU TP_1=TP_71 TP_2=TP_72 Vcomp=Vcomp Vpins=Vpins Vref=Vref
U_ALL_channels/8pins9/dTP: designators IC1=U_ALL_channels_8pins9_dTP_IC1#2 Q1=U_ALL_channels_8pins9_dTP_Q1#2 Q2=U_ALL_channels_8pins9_dTP_Q2#2 Q3=U_ALL_channels_8pins9_dTP_Q3#2 Q4=U_ALL_channels_8pins9_dTP_Q4#2 R5=U_ALL_channels_8pins9_dTP_R5#2 R6=U_ALL_channels_8pins9_dTP_R6#2 R7=U_ALL_channels_8pins9_dTP_R7#2 R8=U_ALL_channels_8pins9_dTP_R8#2; ports CMP_OUT_1=Net8pins9_U3_1 CMP_OUT_2=Net8pins9_U3_5 NMOS_1=Net8pins9_U2_4 NMOS_2=Net8pins9_U2_5 PMOS_1=Net8pins9_U4_4 PMOS_2=Net8pins9_U4_5 PWR_MCU=PWR_MCU TP_1=TP_69 TP_2=TP_70 Vcomp=Vcomp Vpins=Vpins Vref=Vref
U_ALL_channels/8pins9/dTP: designators IC1=U_ALL_channels_8pins9_dTP_IC1#3 Q1=U_ALL_channels_8pins9_dTP_Q1#3 Q2=U_ALL_channels_8pins9_dTP_Q2#3 Q3=U_ALL_channels_8pins9_dTP_Q3#3 Q4=U_ALL_channels_8pins9_dTP_Q4#3 R5=U_ALL_channels_8pins9_dTP_R5#3 R6=U_ALL_channels_8pins9_dTP_R6#3 R7=U_ALL_channels_8pins9_dTP_R7#3 R8=U_ALL_channels_8pins9_dTP_R8#3; ports CMP_OUT_1=Net8pins9_U3_15 CMP_OUT_2=Net8pins9_U3_12 NMOS_1=Net8pins9_U2_2 NMOS_2=Net8pins9_U2_3 PMOS_1=Net8pins9_U4_2 PMOS_2=Net8pins9_U4_3 PWR_MCU=PWR_MCU TP_1=TP_67 TP_2=TP_68 Vcomp=Vcomp Vpins=Vpins Vref=Vref
U_ALL_channels/8pins9/dTP: designators IC1=U_ALL_channels_8pins9_dTP_IC1#4 Q1=U_ALL_channels_8pins9_dTP_Q1#4 Q2=U_ALL_channels_8pins9_dTP_Q2#4 Q3=U_ALL_channels_8pins9_dTP_Q3#4 Q4=U_ALL_channels_8pins9_dTP_Q4#4 R5=U_ALL_channels_8pins9_dTP_R5#4 R6=U_ALL_channels_8pins9_dTP_R6#4 R7=U_ALL_channels_8pins9_dTP_R7#4 R8=U_ALL_channels_8pins9_dTP_R8#4; ports CMP_OUT_1=Net8pins9_U3_13 CMP_OUT_2=Net8pins9_U3_14 NMOS_1=Net8pins9_U2_15 NMOS_2=Net8pins9_U2_1 PMOS_1=Net8pins9_U4_15 PMOS_2=Net8pins9_U4_1 PWR_MCU=PWR_MCU TP_1=TP_65 TP_2=TP_66 Vcomp=Vcomp Vpins=Vpins Vref=Vref
U_ALL_channels/8pins10/dTP: designators IC1=U_ALL_channels_8pins10_dTP_IC1#1 Q1=U_ALL_channels_8pins10_dTP_Q1#1 Q2=U_ALL_channels_8pins10_dTP_Q2#1 Q3=U_ALL_channels_8pins10_dTP_Q3#1 Q4=U_ALL_channels_8pins10_dTP_Q4#1 R5=U_ALL_channels_8pins10_dTP_R5#1 R6=U_ALL_channels_8pins10_dTP_R6#1 R7=U_ALL_channels_8pins10_dTP_R7#1 R8=U_ALL_channels_8pins10_dTP_R8#1; ports CMP_OUT_1=Net8pins10_U3_2 CMP_OUT_2=Net8pins10_U3_4 NMOS_1=Net8pins10_U2_6 NMOS_2=Net8pins10_U2_7 PMOS_1=Net8pins10_U4_6 PMOS_2=Net8pins10_U4_7 PWR_MCU=PWR_MCU TP_1=TP_79 TP_2=TP_80 Vcomp=Vcomp Vpins=Vpins Vref=Vref
U_ALL_channels/8pins10/dTP: designators IC1=U_ALL_channels_8pins10_dTP_IC1#2 Q1=U_ALL_channels_8pins10_dTP_Q1#2 Q2=U_ALL_channels_8pins10_dTP_Q2#2 Q3=U_ALL_channels_8pins10_dTP_Q3#2 Q4=U_ALL_channels_8pins10_dTP_Q4#2 R5=U_ALL_channels_8pins10_dTP_R5#2 R6=U_ALL_channels_8pins10_dTP_R6#2 R7=U_ALL_channels_8pins10_dTP_R7#2 R8=U_ALL_channels_8pins10_dTP_R8#2; ports CMP_OUT_1=Net8pins10_U3_1 CMP_OUT_2=Net8pins10_U3_5 NMOS_1=Net8pins10_U2_4 NMOS_2=Net8pins10_U2_5 PMOS_1=Net8pins10_U4_4 PMOS_2=Net8pins10_U4_5 PWR_MCU=PWR_MCU TP_1=TP_77 TP_2=TP_78 Vcomp=Vcomp Vpins=Vpins Vref=Vref
U_ALL_channels/8pins10/dTP: designators IC1=U_ALL_channels_8pins10_dTP_IC1#3 Q1=U_ALL_channels_8pins10_dTP_Q1#3 Q2=U_ALL_channels_8pins10_dTP_Q2#3 Q3=U_ALL_channels_8pins10_dTP_Q3#3 Q4=U_ALL_channels_8pins10_dTP_Q4#3 R5=U_ALL_channels_8pins10_dTP_R5#3 R6=U_ALL_channels_8pins10_dTP_R6#3 R7=U_ALL_channels_8pins10_dTP_R7#3 R8=U_ALL_channels_8pins10_dTP_R8#3; ports CMP_OUT_1=Net8pins10_U3_15 CMP_OUT_2=Net8pins10_U3_12 NMOS_1=Net8pins10_U2_2 NMOS_2=Net8pins10_U2_3 PMOS_1=Net8pins10_U4_2 PMOS_2=Net8pins10_U4_3 PWR_MCU=PWR_MCU TP_1=TP_75 TP_2=TP_76 Vcomp=Vcomp Vpins=Vpins Vref=Vref
U_ALL_channels/8pins10/dTP: designators IC1=U_ALL_channels_8pins10_dTP_IC1#4 Q1=U_ALL_channels_8pins10_dTP_Q1#4 Q2=U_ALL_channels_8pins10_dTP_Q2#4 Q3=U_ALL_channels_8pins10_dTP_Q3#4 Q4=U_ALL_channels_8pins10_dTP_Q4#4 R5=U_ALL_channels_8pins10_dTP_R5#4 R6=U_ALL_channels_8pins10_dTP_R6#4 R7=U_ALL_channels_8pins10_dTP_R7#4 R8=U_ALL_channels_8pins10_dTP_R8#4; ports CMP_OUT_1=Net8pins10_U3_13 CMP_OUT_2=Net8pins10_U3_14 NMOS_1=Net8pins10_U2_15 NMOS_2=Net8pins10_U2_1 PMOS_1=Net8pins10_U4_15 PMOS_2=Net8pins10_U4_1 PWR_MCU=PWR_MCU TP_1=TP_73 TP_2=TP_74 Vcomp=Vcomp Vpins=Vpins Vref=Vref

### Notes on the sheet
- Analog frontend for 2 channels (dual comparator with P and N MOSFETS)
- 2x this with different labels...
- dual comparator
- (near Q1) output level control
- output level control
- (near Q4) Input impedance control
- (near Q3) Input impedance control
- DAC_output

### Library data of the parts
IC1 = LM393LVQDRQ1: Integrated Circuit; Manufacturer_Name: Texas Instruments; Datasheet Link: https://www.ti.com/lit/gpn/lm393lv-q1; Height: 1.75mm; Manufacturer_Part_Number: LM393LVQDRQ1; Mouser Part Number: 595-LM393LVQDRQ1; Mouser Price/Stock: https://www.mouser.co.uk/ProductDetail/Texas-Instruments/LM393LVQDRQ1?qs=IS%252B4QmGtzzqk8QFsvXuXMw%3D%3D; Arrow Part Number: LM393LVQDRQ1; Arrow Price/Stock: https://www.arrow.com/en/products/lm393lvqdrq1/texas-instruments?region=nac
Q1 Q2 = P-MOSFET: MOSFET (P-Channel) - low RDS on; Manufacturer_Name: Toshiba; Manufacturer_Part_Number: SSM3J358R,LF; Datasheet Link: https://toshiba.semicon-storage.com/ap-en/product/mosfet/detail.SSM3J358R.html; Height: 0.88mm; Mouser Part Number: 757-SSM3J358RLF; Mouser Price/Stock: https://www.mouser.co.uk/ProductDetail/Toshiba/SSM3J358RLF?qs=HXFqYaX1Q2xwvCtt1GGmkw%3D%3D; Arrow Part Number: SSM3J358R,LF; Arrow Price/Stock: https://www.arrow.com/en/products/ssm3j358rlf/toshiba?region=nac
Q3 Q4 = N-MOSFET: N-Channel MOSFET Transistor PJA3432_R1_00001; Manufacturer: Fairchild; Typical Turn-On Delay Time: 3ns; Channel Mode: Enhancement; RDS-on: 450@4.5VmOhm; Maximum Continuous Drain Current: 0.68A; Maximum Drain Source Voltage: 25V; Rad Hard: No; Typical Fall Time: 13ns; Channel Type: N; Typical Turn-Off Delay Time: 17ns; Maximum Gate Source Voltage: 8V; Typical Rise Time: 8.5ns; Mounting: SurfaceMount; Packaging: Tape&Reel; Package: 3SOT-23; Category: MOSFET; Operating Temperature: -55to150degC; Datasheet Version: Rev. D2, 07/2014
R5-R8 = Resistor 0402 100mW: Part Number: ERJ2RKF6800X; Manufacturer: Panasonic

## Sheet POWER.SchDoc
size A3; SheetNumber: 5; SheetTotal: 5
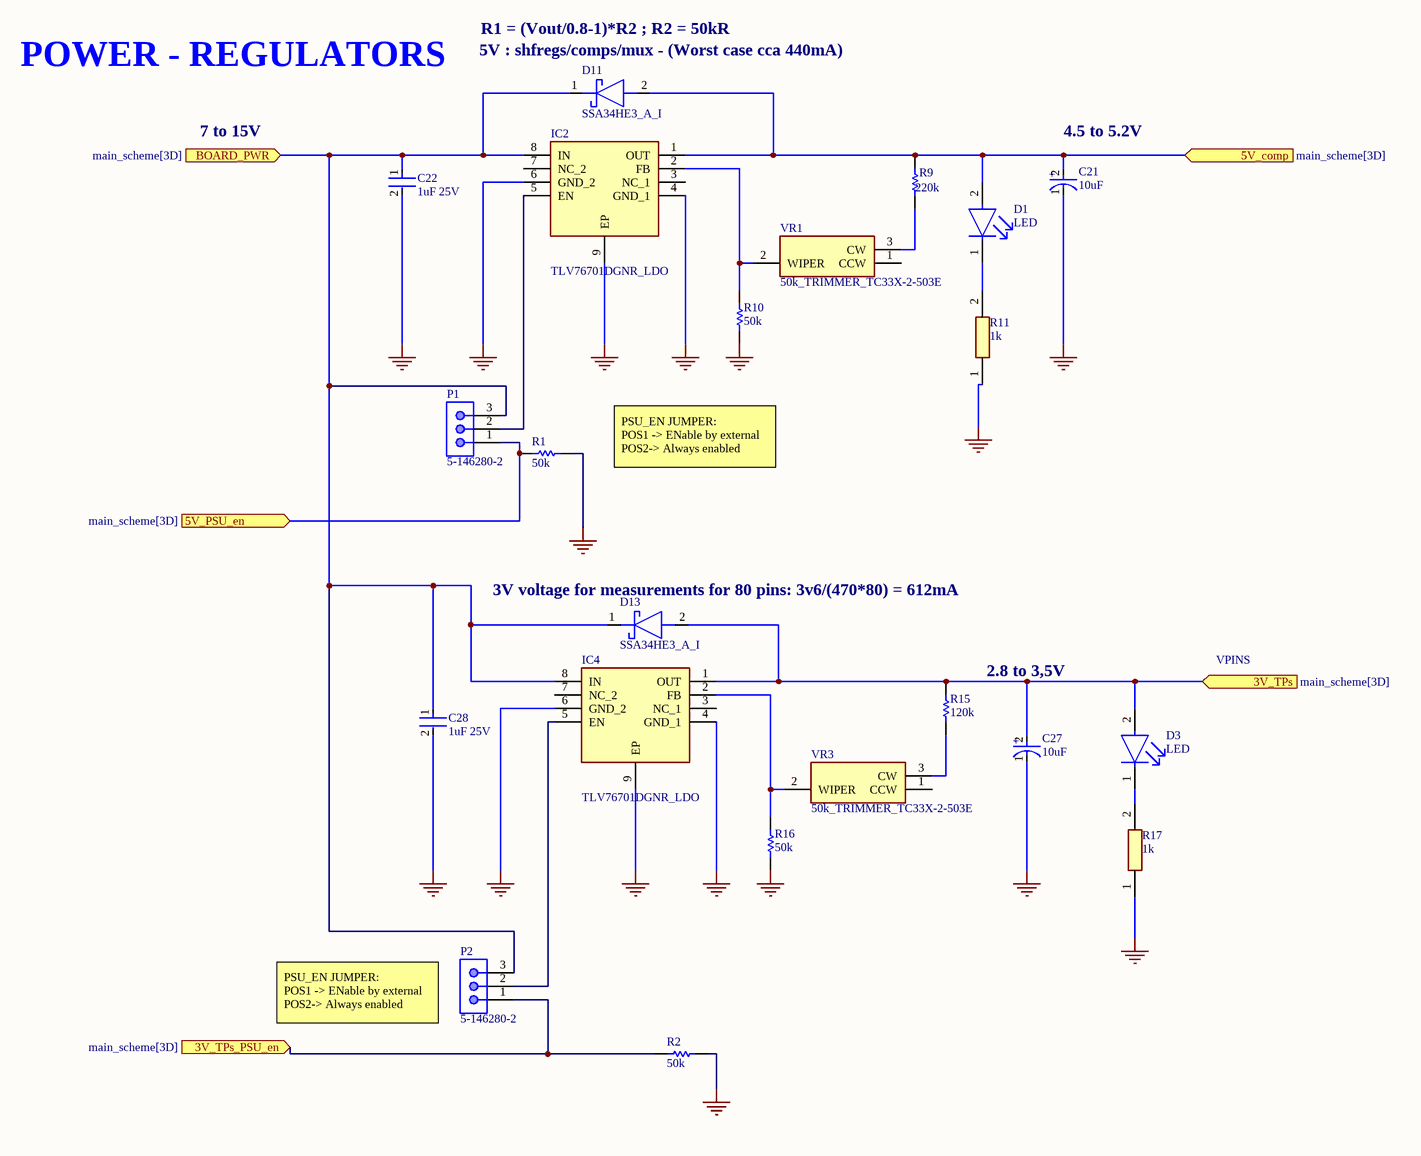
[diagram p4: POWER.SchDoc]

### Parts
C21  10uF  [0603_tantal]
C22  1uF 25V  [0603-CAP]
C27  10uF  [0603_tantal]
C28  1uF 25V  [0603-CAP]
D1  LED  [0603_RED_LED]
D3  LED  [0603_RED_LED]
D11  SSA34HE3_A_I  [DIONM5127X229N]
D13  SSA34HE3_A_I  [DIONM5127X229N]
IC2  TLV76701DGNR_LDO  [SOP65P490X110-9N]
IC4  TLV76701DGNR_LDO  [SOP65P490X110-9N]
P1  5-146280-2  [2.54mm header 3x1]
P2  5-146280-2  [2.54mm header 3x1]
R1  50k  [RESC1005X40X25NL05T05]
R2  50k  [RESC1005X40X25NL05T05]
R9  220k  [RESC1005X40X25NL05T05]
R10  50k  [RESC1005X40X25NL05T05]
R11  1k  [0603- SMD resistor]
R15  120k  [RESC1005X40X25NL05T05]
R16  50k  [RESC1005X40X25NL05T05]
R17  1k  [0603- SMD resistor]
VR1  50k_TRIMMER_TC33X-2-503E  [TC33X2503E]
VR3  50k_TRIMMER_TC33X-2-503E  [TC33X2503E]

### Ports
3V_TPs (in, see main_scheme[3D]), 3V_TPs_PSU_en (in, see main_scheme[3D]), 5V_comp (in, see main_scheme[3D]), 5V_PSU_en (in, see main_scheme[3D]), BOARD_PWR (in, see main_scheme[3D])

### Nets
BOARD_PWR: C22.1 C28.1 D11.1(K) D13.1(K) IC2.8(IN) IC4.8(IN) P1.3 P2.3 ; port BOARD_PWR
GND: C21.1(C) C22.2 C27.1(C) C28.2 IC2.4(GND_1) IC2.6(GND_2) IC2.9(EP) IC4.4(GND_1) IC4.6(GND_2) IC4.9(EP) R1.1 R2.1 R10.2 R11.1 R16.2 R17.1
Vpins: C27.2(A) D3.2(A) D13.2(A) IC4.1(OUT) R15.1 ; port 3V_TPs
3V_en: P2.1 R2.2 ; port 3V_TPs_PSU_en
5V_en: P1.1 R1.2 ; port 5V_PSU_en
Vcomp: C21.2(A) D1.2(A) D11.2(A) IC2.1(OUT) R9.1 ; port 5V_comp
NetD1_1: D1.1(C) R11.2
NetD3_1: D3.1(C) R17.2
NetIC2_2: IC2.2(FB) R10.1 VR1.2(WIPER)
NetIC2_5: IC2.5(EN) P1.2
NetIC4_2: IC4.2(FB) R16.1 VR3.2(WIPER)
NetIC4_5: IC4.5(EN) P2.2
NetR9_2: R9.2 VR1.3(CW)
NetR15_2: R15.2 VR3.3(CW)

Not connected (* = marked no-connect by the designer): IC2 3(NC_1) 7(NC_2); IC4 3(NC_1) 7(NC_2); VR1 1(CCW); VR3 1(CCW)

### Notes on the sheet
- POWER - REGULATORS
- (near D11) 5V : shfregs/comps/mux - (Worst case cca 440mA)
- R1 = (Vout/0.8-1)*R2 ; R2 = 50kR
- 7 to 15V
- (near C21) 4.5 to 5.2V
- PSU_EN JUMPER:
  POS1 -> ENable by external
  POS2-> Always enabled
- (near D13) 3V voltage for measurements for 80 pins: 3v6/(470*80) = 612mA
- 2.8 to 3,5V
- VPINS
- (near P2) PSU_EN JUMPER:
  POS1 -> ENable by external
  POS2-> Always enabled
- (in symbol 0603 TantalCAP) +

### Library data of the parts
C21 C27 = 0603 TantalCAP: CAP TANT POLY 10UF 10V SMD; Manufacturer Part Number: F381A106MMAAH1; Manufacturer: AVX; Material: Tantalum-Polymer; Life: 1000Hours; Ripple Current: 289mA; Leakage Current: 10uA; Dissipation Factor: 15%; Esr: 300mΩ; Tolerance: 20%; Category: Cap; ComponentLink2URL: http://datasheets.avx.com/F38.pdf; Automotive: No; Package: F38M; Device Class L2: Capacitors; Octopart: https://octopart.com/f381a106mmaah1-avx-67040376; Device Class L1: Passive Components; Lead Free: Yes; Temperature Range High: +105°C; ComponentLink2Description: Datasheet; Digikey Description: CAP TANT POLY 10UF 10V SMD; Value: 10uF; Temperature Range Low: -55°C; Temperature: -55°C to +105°C; Device Class L3: Polymer Capacitors; Capacitance: 10uF; Height: 0.9mm; Footprint Url: http://www.avx.com/download/software/literature/AVX-Footprint-Library.pdf; RoHS: TRUE; Voltage Rating: 10V; Mouser Description: Cap Tant Polymer 10uF 10VDC M CASE 20% (1.6 X 0.85 X 0.8mm) Undertab SMD 1608-09 0.3 Ohm 105C T/R
C22 C28 = 0603-CAP: General Purpose Ceramic Capacitor, 0603, 1uF, 10%, X5R, 15%, 25V; Tolerance: 20%; Voltage Rating: 6.3V; Voltage Rating (DC): 25V; RoHS Compliant: Yes; Thickness: 0.035inch; Voltage: 25V; Number of Pins: 2; Case Code (Metric): 1608; Dielectric: X5R; Height: 0.9mm; Case Code (Imperial): 0603; Contact Plating: Tin; REACH SVHC: No SVHC; Package Quantity: 1; Case/Package: 0603; Capacitance: 1uF; Lead Free: Lead Free; Series: -; Termination: SMD/SMT; Mount: Surface Mount; Min Operating Temperature: -55°C; Construction: Flat; Packaging: Tape and Reel; Max Operating Temperature: 85°C; Dielectric Material: Ceramic; Length: 1.6mm; Depth: 0.81mm; Radiation Hardening: No; Width: 0.032inch
D1 D3 = 0603_RED_LED_2V2: LED RED DIFFUSED 1608 SMD; Manufacturer: Rohm; Manufacturer Part Number: SML-D12U1WT86; Led Orientation: Top View; Power Dissipation: 54mW; Forward Current: 20mA; Wavelength: 620nm; Reverse Voltage: 5V; Luminous Intensity: 63mcd; Forward Voltage: 2.2V; Mouser Description: SML-D12 Series Red 0603 Diffused 63 mcd 2.2 V Surface Mount LED; Temperature: -40°C to +85°C; Device Class L2: LEDs; Lead Free: Yes; Automotive: No; Octopart: https://octopart.com/sml-d12u1wt86-rohm-70850259; RoHS: TRUE; Colour: Red; Digikey Description: LED RED DIFFUSED 1608 SMD; Package: SML-D12; Device Class L1: Optoelectronics; Category: Diode; Temperature Range High: +85°C; Height: 0.65mm; ComponentLink2Description: Datasheet; Temperature Range Low: -40°C; ComponentLink2URL: https://www.rohm.com/datasheet/SML-D12U1W/sml-d12x1-e; Device Class L3: unset
D11 D13 = SSA34HE3_A_I: Schottky Diode; Manufacturer_Name: Vishay; Manufacturer_Part_Number: SSA34HE3_A/I; Datasheet Link: https://componentsearchengine.com/Datasheets/1/SSA34HE3_A_I.pdf; Height: 2.29mm; Mouser Part Number: 78-SSA34HE3_A/I; Mouser Price/Stock: https://www.mouser.co.uk/ProductDetail/Vishay-General-Semiconductor/SSA34HE3_A-I?qs=asPD7ZL2j3VimMFbwwU%2FoA%3D%3D; Arrow Part Number: SSA34HE3_A/I; Arrow Price/Stock: https://www.arrow.com/en/products/ssa34he3-ai/vishay?region=nac
IC2 IC4 = TLV76701DGNR_LDO: Integrated Circuit; Manufacturer_Name: Texas Instruments; Datasheet Link: https://www.ti.com/lit/ds/symlink/tlv767.pdf?ts=1634721803014&ref_url=https%253A%252F%252Fwww.ti.com%252Fproduct%252FTLV767; Height: 1.1mm; Manufacturer_Part_Number: TLV76701DGNR
P1 P2 = 3x1 Header: Male Header, Pitch 2.54 mm, 1 x 2 Position, Height 8.21 mm, Tail Length 3.05 mm, -65 to 105 degC, RoHS, Bulk; Manufacturer: TE Connectivity; Mating Connector Lock: No(Without); Number of Positions: 2; Pitch: 2.54mm; PCB Mounting Orientation: Vertical; Keyed: No; Case\/Package: 100; Mating Post Length: 0.23inch; High Temperature Housing: Yes; Max Current Rating: 5A; PCB Thickness: 0.063inch; PCB Mount Retention: Without; Approvals: CSA; Current Rating: 3A; Radiation Hardening: No; Length: 4.67mm; Contact Mating Length: 0.23inch; Connector Type: Header; Number of Rows: 1; Termination Post Length: 0.12inch; Board Standoff: No(Without); Max Operating Temperature: 105degC; Contact Shape: Square; Selectively Loaded: No(Without); Gasket: No(Without); Number of Contacts: 2; Contact Gender: Male; Mating Alignment: No(Without); Manufacturer URL: http://www.te.com/; Datasheet URL: http://www.te.com/commerce/DocumentDelivery/DDEController?Action=showdoc&DocId=Customer+Drawing%7F146280%7FH1%7Fpdf%7FEnglish%7FENG_CD_146280_H1.pdf%7F5-146280-2; Mount: ThroughHole; Orientation: Straight; Packaging: Carton; Package Reference: 5-146280-2; Package Quantity: 500; Stabilizers: No(Without); Row Spacing: 2.54mm; Contact Material: CopperAlloy; Panel Mount Retention: No(Without); Datasheet Version: Rev. H1, 08/2016; Housing Colour: Black; Colour: Black; Package Description: Male Header, Pitch 2.54 mm, 1 x 2 Position, Height 8.21 mm, Tail Length 3.05 mm; Contact Plating: Matte; Housing Material: Polymer; Contact Protection: No(Without); Min Operating Temperature: -65degC; Mounting Technology: ThroughHole; Flammability Rating: UL94V-0; RoHSCompliant: true; Termination: ThroughHole; Depth: 2.34mm; High Speed Serial Data Connector: No
R1 R2 R9 R10 R15 R16 = Resistor 0402 100mW: as R5 on sheet TPs
R11 R17 = 0603 - SMD RESISTOR: Resistor; Manufacturer_Name: Bourns; Manufacturer_Part_Number: CR0603-J/-9R1ELF; Datasheet Link: https://www.bourns.com/pdfs/chpreztr.pdf; Height: 0.55mm; Mouser Part Number: 652-CR0603-J/-9R1ELF; Mouser Price/Stock: https://www.mouser.com/Search/Refine.aspx?Keyword=652-CR0603-J%2F-9R1ELF
VR1 VR3 = 50k_TRIMMER_TC33X-2-503E: Variable Resistor; Manufacturer_Name: Bourns; Datasheet Link: https://componentsearchengine.com/Datasheets/1/TC33X-2-503E.pdf; Height: 1.2mm; Manufacturer_Part_Number: TC33X-2-503E; Mouser Part Number: 652-TC33X-2-503E; Mouser Price/Stock: https://www.mouser.co.uk/ProductDetail/Bourns/TC33X-2-503E?qs=tEaODSGlU8NgxHjveDtEEg%3D%3D; Arrow Part Number: TC33X-2-503E; Arrow Price/Stock: https://www.arrow.com/en/products/tc33x-2-503e/bourns?region=nac